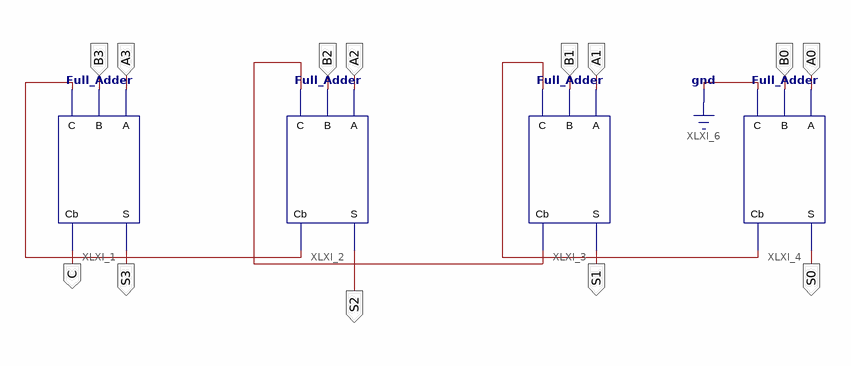
[diagram p0: schematic sheet 1]
// Xilinx ISE schematic Ripple_Carry_Adder_4_Bit.sch (spartan3e) as structural Verilog: 4 symbols, 13 ports
module Ripple_Carry_Adder_4_Bit (
  input  A0,
  input  B0,
  input  A1,
  input  B1,
  input  A2,
  input  B2,
  input  B3,
  input  A3,
  output S0,
  output S1,
  output S3,
  output C,
  output S2
);

  wire XLXN_22, XLXN_23, XLXN_24;

  Full_Adder XLXI_1 (.A(A3), .B(B3), .C(XLXN_24), .S(S3), .Cb(C));
  Full_Adder XLXI_2 (.A(A2), .B(B2), .C(XLXN_23), .S(S2), .Cb(XLXN_24));
  Full_Adder XLXI_3 (.A(A1), .B(B1), .C(XLXN_22), .S(S1), .Cb(XLXN_23));
  Full_Adder XLXI_4 (.A(A0), .B(B0), .C(1'b0), .S(S0), .Cb(XLXN_22));
endmodule
